# EAGLE design Power Distribution (EAGLE 9.6.2)
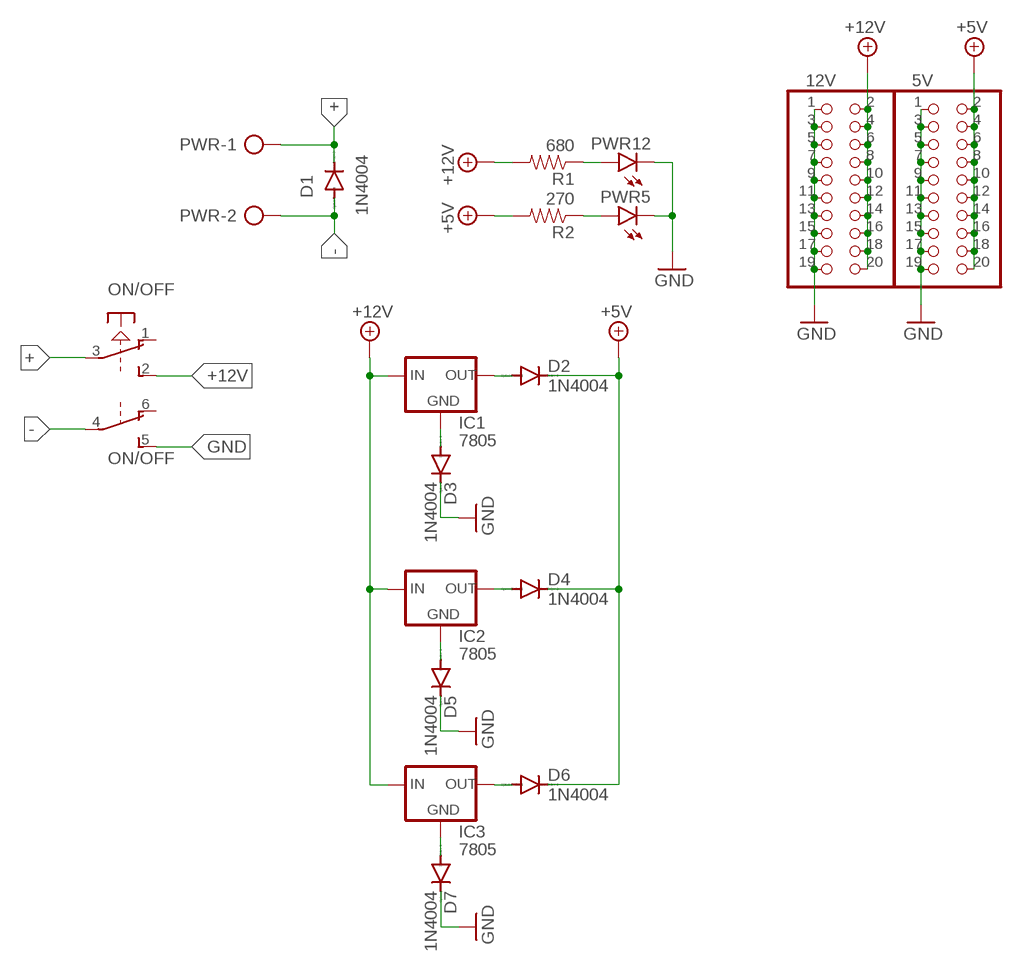
[diagram p0: schematic, sheet 1]

## Parts
5V  PINHD-2X10  [2X10]
12V  PINHD-2X10  [2X10]
D1  1N4004  [DO41-10]
D2  1N4004  [DO41-10]
D3  1N4004  [DO41-10]
D4  1N4004  [DO41-10]
D5  1N4004  [DO41-10]
D6  1N4004  [DO41-10]
D7  1N4004  [DO41-10]
IC1  7805  78XXS  [78XXS]
IC2  7805  78XXS  [78XXS]
IC3  7805  78XXS  [78XXS]
ON/OFF  PVA2R  [PVA2R]
PWR  AK500/2-H  [AK500/2-H]
PWR5  LED3MM  [LED3MM]
PWR12  LED3MM  [LED3MM]
R1  680  RESISTORAXIAL-0.3  [AXIAL-0.3]
R2  270  RESISTORAXIAL-0.3  [AXIAL-0.3]

## Nets
+: D1.C ON/OFF.3(1:P) PWR.1
+5V: 5V.2 5V.4 5V.6 5V.8 5V.10 5V.12 5V.14 5V.16 5V.18 5V.20 D2.C D4.C D6.C R2.P$2
+12V: 12V.2 12V.4 12V.6 12V.8 12V.10 12V.12 12V.14 12V.16 12V.18 12V.20 IC1.IN IC2.IN IC3.IN ON/OFF.2(1:S) R1.P$2
-: D1.A ON/OFF.4(2:P) PWR.2
GND: 5V.1 5V.3 5V.5 5V.7 5V.9 5V.11 5V.13 5V.15 5V.17 5V.19 12V.1 12V.3 12V.5 12V.7 12V.9 12V.11 12V.13 12V.15 12V.17 12V.19 D3.C D5.C D7.C ON/OFF.5(2:S) PWR5.K(C) PWR12.K(C)
N$3: PWR12.A R1.P$1
N$4: D7.A IC3.GND
N$5: PWR5.A R2.P$1
N$6: D5.A IC2.GND
N$7: D3.A IC1.GND
N$8: D2.A IC1.OUT
N$9: D6.A IC3.OUT
N$10: D4.A IC2.OUT
Unconnected: ON/OFF.1(1:O) ON/OFF.6(2:O)

## Library data of the parts
5V 12V = pinhead:PINHD-2X10: PIN HEADER
D1-D7 = diode:1N4004: DIODE general purpose rectifier, 1 A
IC1-IC3 = v-reg:78XXS: VOLTAGE REGULATOR
ON/OFF = switch-misc:PVA2R: ITT SWITCH
PWR = con-ptr500:AK500/2-H: CONNECTOR Aug. 2004 / PTR Meßtechnik: Die Bezeichnung der Serie AK505 wurde geändert. Es handelt sich hierbei um AK500 in horizontaler Ausführung.; OC_FARNELL: unknown; OC_NEWARK: unknown
PWR5 PWR12 = led:LED: LED OSRAM: - CHIPLED LG R971, LG N971, LY N971, LG Q971, LY Q971, LO R971, LY R971 LH N974, LH R974 LS Q976, LO Q976, LY Q976 LO Q996 - Hyper CHIPLED LW Q18S LB Q993, LB Q99A, LB R99A - SideLED LS A670, LO A670, LY A670, LG A670, LP A670 LB A673, LV A673, LT A673, LW A673 LH A674 LY A675 LS A676, LA A676, LO A676, LY A676, LW A676 LS A679, LY A679, LG A679 - Hyper Micro SIDELED® LS Y876, LA Y876, LO Y876, LY Y876 LT Y87S - SmartLED LW L88C, LW L88S LB L89C, LB L89S, LG L890 LS L89K, LO L89K, LY L89K LS L896, LA L896, LO L896, LY L896 - TOPLED LS T670, LO T670, LY T670, LG T670, LP T670 LSG T670, LSP T670, LSY T670, LOP T670, LYG T670 LG T671, LOG T671, LSG T671 LB T673, LV T673, LT T673, LW T673 LH T674 LS T676, LA T676, LO T676, LY T676, LB T676, LH T676, LSB T676, LW T676 LB T67C, LV T67C, LT T67C, LS T67K, LO T67K, LY T67K, LW E67C LS E67B, LA E67B, LO E67B, LY E67B, LB E67C, LV E67C, LT E67C LW T67C LS T679, LY T679, LG T679 LS T770, LO T770, LY T770, LG T770, LP T770 LB T773, LV T773, LT T773, LW T773 LH T774 LS E675, LA E675, LY E675, LS T675 LS T776, LA T776, LO T776, LY T776, LB T776 LHGB T686 LT T68C, LB T68C - Hyper Mini TOPLED® LB M676 - Mini TOPLED Santana® LG M470 LS M47K, LO M47K, LY M47K Source: http://www.osram.convergy.de LUXEON: - LUMILED® LXK2-PW12-R00, LXK2-PW12-S00, LXK2-PW14-U00, LXK2-PW14-V00 LXK2-PM12-R00, LXK2-PM12-S00, LXK2-PM14-U00 LXK2-PE12-Q00, LXK2-PE12-R00, LXK2-PE12-S00, LXK2-PE14-T00, LXK2-PE14-U00 LXK2-PB12-K00, LXK2-PB12-L00, LXK2-PB12-M00, LXK2-PB14-N00, LXK2-PB14-P00, LXK2-PB14-Q00 LXK2-PR12-L00, LXK2-PR12-M00, LXK2-PR14-Q00, LXK2-PR14-R00 LXK2-PD12-Q00, LXK2-PD12-R00, LXK2-PD12-S00 LXK2-PH12-R00, LXK2-PH12-S00 LXK2-PL12-P00, LXK2-PL12-Q00, LXK2-PL12-R00 Source: www.luxeon.com KINGBRIGHT: KA-3528ASYC Source: www.kingbright.com
R1 R2 = SparkFun-Resistors:RESISTOR: Generic Resistor Package

## Board
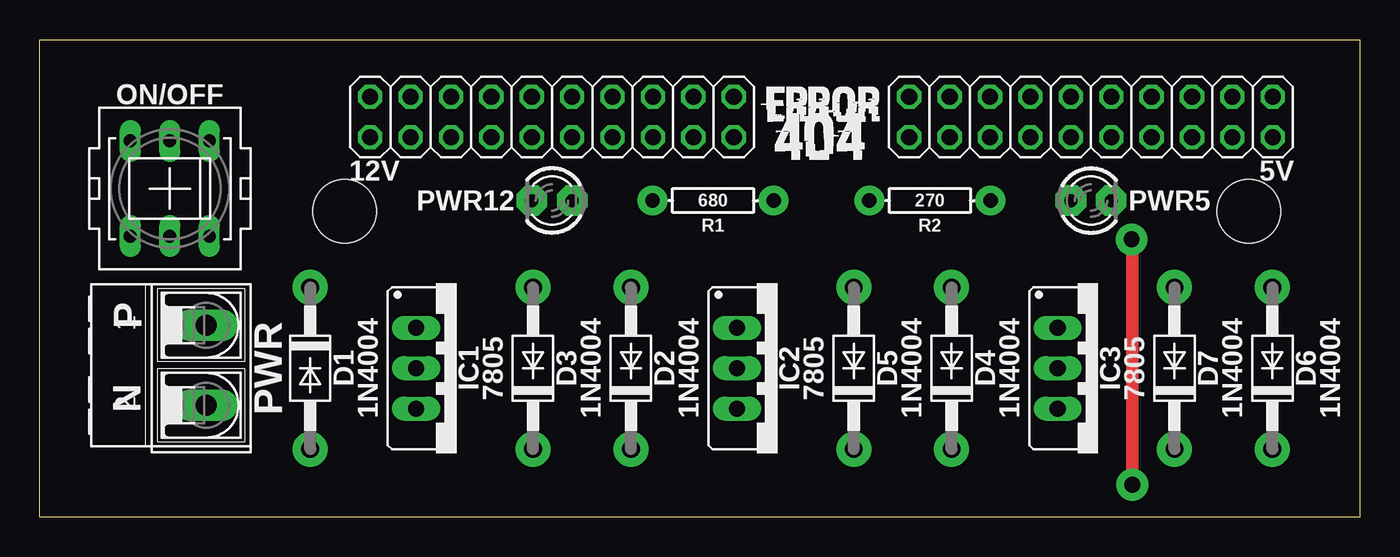
[diagram p1: board, top side]
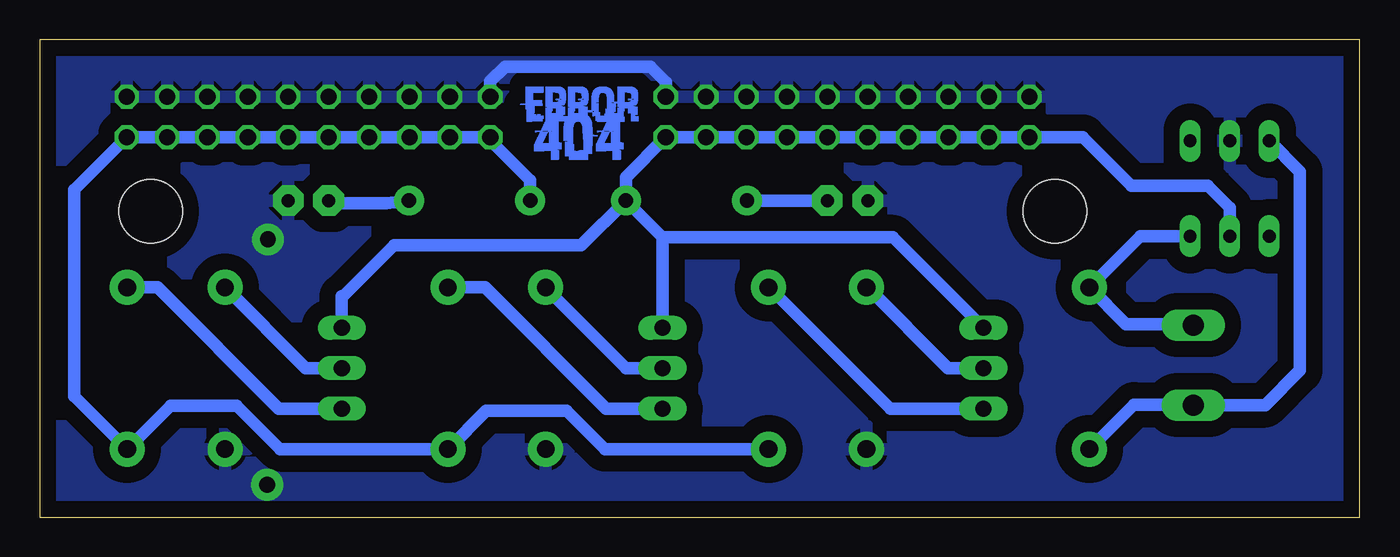
[diagram p2: board, bottom side, seen from below]

Size 83 x 30 mm. Coordinates in mm from the lower left corner, seen from the top.
Outline: 0,30 83,30 83,0 0,0 0,30
Copper layers (1*16): Top 0.035mm / dielectric 1.5mm / Bottom 0.035mm
Design rules "default *": minimum track width 0.8mm, minimum drill 0.7mm, track to track 0.6mm, track to pad 0.6mm, pad to pad 0.6mm, via to via 0.6mm, smd to smd 6mil, copper to edge 40mil, drill to drill 6mil, minimum pad ring 10mil, minimum via ring 8mil, stop-mask expansion 4mil, vias tented up to drill 0mil, thermal gap 10mil
Holes 4 mm at 76.02,19.23 19.18,19.23

### Footprints (pad centres in the part's own frame; a part is rotated, then mirrored left to right if it is on the bottom)
2X10 = drill 1.016 octagon: 1 -11.43,-1.27; 2 -11.43,1.27; 3 -8.89,-1.27; 4 -8.89,1.27; 5 -6.35,-1.27; 6 -6.35,1.27; 7 -3.81,-1.27; 8 -3.81,1.27; 9 -1.27,-1.27; 10 -1.27,1.27; 11 1.27,-1.27; 12 1.27,1.27; 13 3.81,-1.27; 14 3.81,1.27; 15 6.35,-1.27; 16 6.35,1.27; 17 8.89,-1.27; 18 8.89,1.27; 19 11.43,-1.27; 20 11.43,1.27
DO41-10 = drill 1.118 pad 2.2: A 5.08,0; C -5.08,0
78XXS = drill 1.016 long: GND 0,-2.54; IN -2.54,-2.54; OUT 2.54,-2.54
PVA2R = drill 0.813 long: 1 -2.997,2.489; 2 -2.997,0; 3 -2.997,-2.489; 4 2.997,2.489; 5 2.997,0; 6 2.997,-2.489
AK500/2-H = drill 1.321 long: 1 -2.515,0; 2 2.515,0
LED3MM = drill 0.813 pad 1.93 octagon: A -1.27,0; K 1.27,0
AXIAL-0.3 = drill 0.9 pad 1.88: P$1 -3.81,0; P$2 3.81,0

### Placement (x,y rotation side)
5V  66.1,25.15 180 top
12V  32.21,25.15 180 top
D1  17,9.35 270 top
D2  37.17,9.35 90 top
D3  31.01,9.35 90 top
D4  57.34,9.35 90 top
D5  51.18,9.35 90 top
D6  77.51,9.35 90 top
D7  71.35,9.35 90 top
IC1  26.21,9.35 270 top
IC2  46.37,9.35 270 top
IC3  66.54,9.35 270 top
ON/OFF  8.18,20.65 90 top
PWR  10.46,9.54 270 top
PWR5  66.1,19.89 0 top
PWR12  32.21,19.89 180 top
R1  42.34,19.89 0 top
R2  55.97,19.89 180 top
U$1  [ERROR404_X0.5_T]  48.63,24.97 0 bottom
U$2  [ERROR404_X0.5_TN]  49.51,24.97 0 top

### Tracks (layer width: path | path; a pad name or v marks a point on that pad's centre or on a via)
+
  Bottom 0.8: PWR.1 10.54,12.13 14.7,12.13 D1.C 13.78,17.65 ON/OFF.3
+5V
  Bottom 0.8: D2.C 47.46,4.27 49.87,6.69 54.93,6.69 D4.C 67.87,4.27 70.61,7.01 74.77,7.01 D6.C 80.82,7.59 80.82,20.59 5V.2 5V.4 5V.6 5V.8 5V.10 5V.12 5V.14 5V.16 5V.18 5V.20 54.67,23.68 52.16,21.16 R2.P$2
+12V
  Bottom 0.8: 64,13.87 64,13.8 | ON/OFF.2 8.18,19.46 9.55,20.83 14.35,20.83 17.4,23.88 12V.20 12V.18 12V.16 12V.14 12V.12 12V.10 12V.8 12V.6 12V.4 12V.2 | 12V.2 43.64,23.68 | 64,13.8 IC3.IN | 64,13.8 60.72,17.08 48.96,17.08 R1.P$2 | 12V.2 46.15,21.37 R1.P$2 | IC2.IN 43.83,17.58 | 43.83,17.58 R1.P$2 | 43.83,17.58 29.35,17.58 IC1.IN
-
  Bottom 0.8: D1.A 14.2,7.07 10.51,7.07 PWR.2 5.95,7.03 3.76,9.22 3.76,21.72 ON/OFF.4
GND  (via drill 1 pad 2)
  Top 0.8: v68.66,17.45 68.71,17.4 v68.71,2.03
  Bottom 0.8: 12V.1 43.64,27.33 44.61,28.3 53.75,28.3 54.67,27.38 5V.19
  pour Bottom (isolate 1.016): -3.43,35.31 92.99,35.31 92.99,-2.34 -3.43,-2.34
N$3
  Bottom 0.8: 37.26,19.89 R1.P$1 37.26,19.89 | 37.26,19.89 PWR12.A
N$4
  Bottom 0.8: IC3.GND 66.27,9.35 D7.A
N$5
  Bottom 0.8: R2.P$1 61.21,19.74 64.67,19.74 PWR5.A
N$6
  Bottom 0.8: IC2.GND 46.13,9.35 51.18,14.4 D5.A
N$7
  Bottom 0.8: D3.A 30.97,14.43 25.89,9.35 IC1.GND
N$8
  Bottom 0.8: IC1.OUT 29.52,6.81 37.14,14.43 D2.A
N$9
  Bottom 0.8: 64.02,6.8 IC3.OUT 67.98,6.81 75.6,14.43 D6.A
N$10
  Bottom 0.8: IC2.OUT 47.39,6.81 55.01,14.43 D4.A

### Text on the board
tPlace: P | N